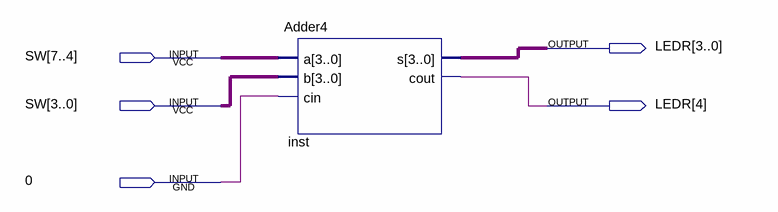
[diagram p0: schematic sheet]
// Quartus schematic AdderDemo.bdf as structural Verilog: 1 symbols, 5 pins
module AdderDemo (
  input  [7:0] SW,
  input  \0 ,
  output [4:0] LEDR
);

  Adder4 inst (.a(SW[7:4]), .b(SW[3:0]), .cin(\0 ), .s(LEDR[3:0]), .cout(LEDR[4]));
endmodule
